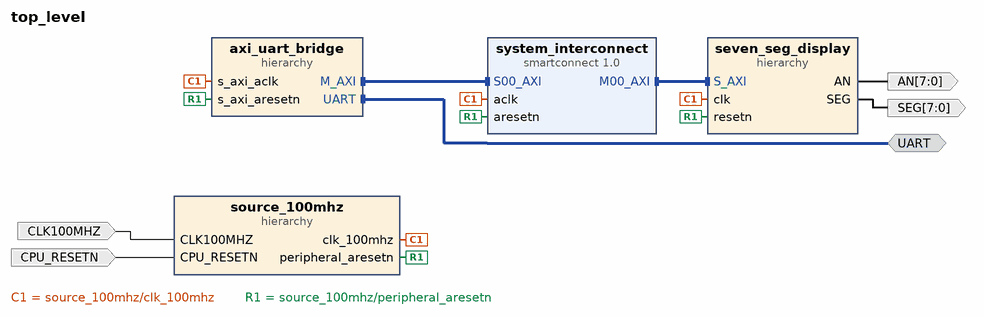
[diagram p0: block diagram of the top level]
# Vivado block design top_level, xc7a100tcsg324-1, Vivado 2021.1
create_bd_design top_level

create_bd_intf_port -mode Master -vlnv xilinx.com:interface:uart_rtl:1.0 UART
create_bd_port -dir I -type clk CLK100MHZ
create_bd_port -dir I -type rst CPU_RESETN
create_bd_port -dir O -from 7 -to 0 AN
create_bd_port -dir O -from 7 -to 0 SEG

create_bd_cell -type hier source_100mhz
create_bd_cell -type ip -vlnv xilinx.com:ip:smartconnect:1.0 system_interconnect
set_property -dict {CONFIG.NUM_SI 1} [get_bd_cells system_interconnect]
create_bd_cell -type hier axi_uart_bridge
create_bd_cell -type hier seven_seg_display

# ---- hierarchy /source_100mhz ----
current_bd_instance /source_100mhz
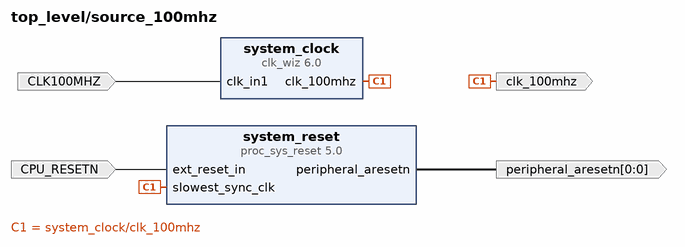
[diagram p1: block diagram inside /source_100mhz]
create_bd_pin -dir I -type clk CLK100MHZ
create_bd_pin -dir I -type rst CPU_RESETN
create_bd_pin -dir O -from 0 -to 0 peripheral_aresetn
create_bd_pin -dir O clk_100mhz

create_bd_cell -type ip -vlnv xilinx.com:ip:clk_wiz:6.0 system_clock
set_property -dict {CONFIG.CLK_OUT1_PORT clk_100mhz CONFIG.USE_LOCKED false CONFIG.USE_RESET false} [get_bd_cells system_clock]
create_bd_cell -type ip -vlnv xilinx.com:ip:proc_sys_reset:5.0 system_reset

# ---- hierarchy /axi_uart_bridge ----
current_bd_instance /axi_uart_bridge
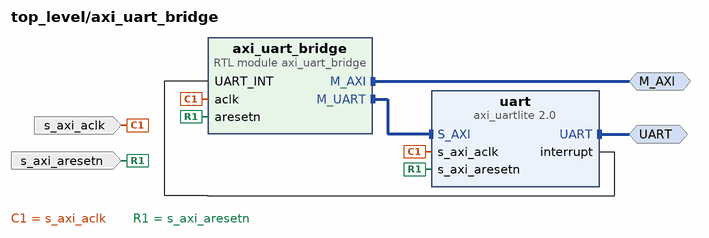
[diagram p2: block diagram inside /axi_uart_bridge]
create_bd_intf_pin -mode Master -vlnv xilinx.com:interface:aximm_rtl:1.0 M_AXI
create_bd_intf_pin -mode Master -vlnv xilinx.com:interface:uart_rtl:1.0 UART
create_bd_pin -dir I -type clk s_axi_aclk
create_bd_pin -dir I -type rst s_axi_aresetn

create_bd_cell -type module -reference axi_uart_bridge axi_uart_bridge
create_bd_cell -type ip -vlnv xilinx.com:ip:axi_uartlite:2.0 uart
set_property -dict {CONFIG.C_BAUDRATE 115200} [get_bd_cells uart]

# ---- hierarchy /seven_seg_display ----
current_bd_instance /seven_seg_display
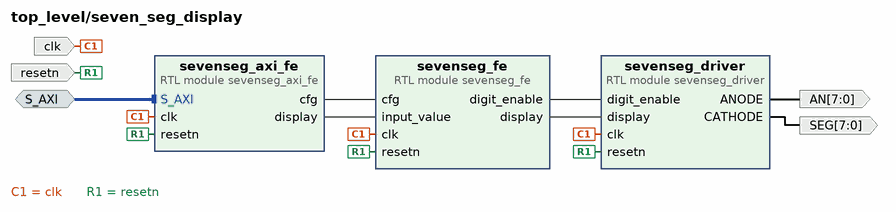
[diagram p3: block diagram inside /seven_seg_display]
create_bd_intf_pin -mode Slave -vlnv xilinx.com:interface:aximm_rtl:1.0 S_AXI
create_bd_pin -dir I -type clk clk
create_bd_pin -dir I -type rst resetn
create_bd_pin -dir O -from 7 -to 0 AN
create_bd_pin -dir O -from 7 -to 0 SEG

create_bd_cell -type module -reference sevenseg_fe sevenseg_fe
create_bd_cell -type module -reference sevenseg_driver sevenseg_driver
create_bd_cell -type module -reference sevenseg_axi_fe sevenseg_axi_fe

# ---- connections ----

current_bd_instance /source_100mhz
connect_bd_net -net clk_in1_0_1 [get_bd_pins CLK100MHZ] [get_bd_pins system_clock/clk_in1]
connect_bd_net -net ext_reset_in_0_1 [get_bd_pins CPU_RESETN] [get_bd_pins system_reset/ext_reset_in]
connect_bd_net -net proc_sys_reset_0_peripheral_aresetn [get_bd_pins system_reset/peripheral_aresetn] [get_bd_pins peripheral_aresetn]
connect_bd_net [get_bd_pins system_clock/clk_100mhz] [get_bd_pins system_reset/slowest_sync_clk] [get_bd_pins clk_100mhz]

current_bd_instance /axi_uart_bridge
connect_bd_intf_net [get_bd_intf_pins M_AXI] [get_bd_intf_pins axi_uart_bridge/M_AXI]
connect_bd_intf_net [get_bd_intf_pins uart/S_AXI] [get_bd_intf_pins axi_uart_bridge/M_UART]
connect_bd_intf_net [get_bd_intf_pins UART] [get_bd_intf_pins uart/UART]
connect_bd_net -net source_100mhz_clk_100mhz [get_bd_pins s_axi_aclk] [get_bd_pins uart/s_axi_aclk] [get_bd_pins axi_uart_bridge/aclk]
connect_bd_net -net source_100mhz_peripheral_aresetn [get_bd_pins s_axi_aresetn] \
  [get_bd_pins uart/s_axi_aresetn] [get_bd_pins axi_uart_bridge/aresetn]
connect_bd_net [get_bd_pins uart/interrupt] [get_bd_pins axi_uart_bridge/UART_INT]

current_bd_instance /seven_seg_display
connect_bd_intf_net -intf_net system_interconnect_M00_AXI [get_bd_intf_pins S_AXI] [get_bd_intf_pins sevenseg_axi_fe/S_AXI]
connect_bd_net -net sevenseg_axi_fe_0_cfg [get_bd_pins sevenseg_axi_fe/cfg] [get_bd_pins sevenseg_fe/cfg]
connect_bd_net -net sevenseg_axi_fe_0_display [get_bd_pins sevenseg_axi_fe/display] [get_bd_pins sevenseg_fe/input_value]
connect_bd_net [get_bd_pins sevenseg_driver/ANODE] [get_bd_pins AN]
connect_bd_net [get_bd_pins sevenseg_driver/CATHODE] [get_bd_pins SEG]
connect_bd_net [get_bd_pins sevenseg_fe/digit_enable] [get_bd_pins sevenseg_driver/digit_enable]
connect_bd_net [get_bd_pins sevenseg_fe/display] [get_bd_pins sevenseg_driver/display]
connect_bd_net -net source_100mhz_clk_100mhz [get_bd_pins clk] \
  [get_bd_pins sevenseg_fe/clk] [get_bd_pins sevenseg_driver/clk] [get_bd_pins sevenseg_axi_fe/clk]
connect_bd_net -net source_100mhz_peripheral_aresetn [get_bd_pins resetn] \
  [get_bd_pins sevenseg_fe/resetn] [get_bd_pins sevenseg_driver/resetn] [get_bd_pins sevenseg_axi_fe/resetn]

current_bd_instance /
connect_bd_intf_net [get_bd_intf_pins axi_uart_bridge/M_AXI] [get_bd_intf_pins system_interconnect/S00_AXI]
connect_bd_intf_net [get_bd_intf_pins seven_seg_display/S_AXI] [get_bd_intf_pins system_interconnect/M00_AXI]
connect_bd_intf_net -intf_net uart_UART [get_bd_intf_ports UART] [get_bd_intf_pins axi_uart_bridge/UART]
connect_bd_net -net clk_in1_0_1 [get_bd_ports CLK100MHZ] [get_bd_pins source_100mhz/CLK100MHZ]
connect_bd_net -net ext_reset_in_0_1 [get_bd_ports CPU_RESETN] [get_bd_pins source_100mhz/CPU_RESETN]
connect_bd_net -net sevenseg_driver_ANODE [get_bd_pins seven_seg_display/AN] [get_bd_ports AN]
connect_bd_net -net sevenseg_driver_CATHODE [get_bd_pins seven_seg_display/SEG] [get_bd_ports SEG]
connect_bd_net [get_bd_pins source_100mhz/clk_100mhz] \
  [get_bd_pins system_interconnect/aclk] [get_bd_pins axi_uart_bridge/s_axi_aclk] [get_bd_pins seven_seg_display/clk]
connect_bd_net [get_bd_pins source_100mhz/peripheral_aresetn] \
  [get_bd_pins system_interconnect/aresetn] [get_bd_pins axi_uart_bridge/s_axi_aresetn] \
  [get_bd_pins seven_seg_display/resetn]

# ---- address map ----
assign_bd_address -offset 0x0000000000001000 -range 128 -target_address_space [get_bd_addr_spaces axi_uart_bridge/axi_uart_bridge/M_AXI] [get_bd_addr_segs seven_seg_display/sevenseg_axi_fe/S_AXI/reg0]
assign_bd_address -offset 0x40600000 -range 64K -target_address_space [get_bd_addr_spaces axi_uart_bridge/axi_uart_bridge/M_UART] [get_bd_addr_segs axi_uart_bridge/uart/S_AXI/Reg]

validate_bd_design
save_bd_design
